# EAGLE design コントローラ (EAGLE 9.6.2)
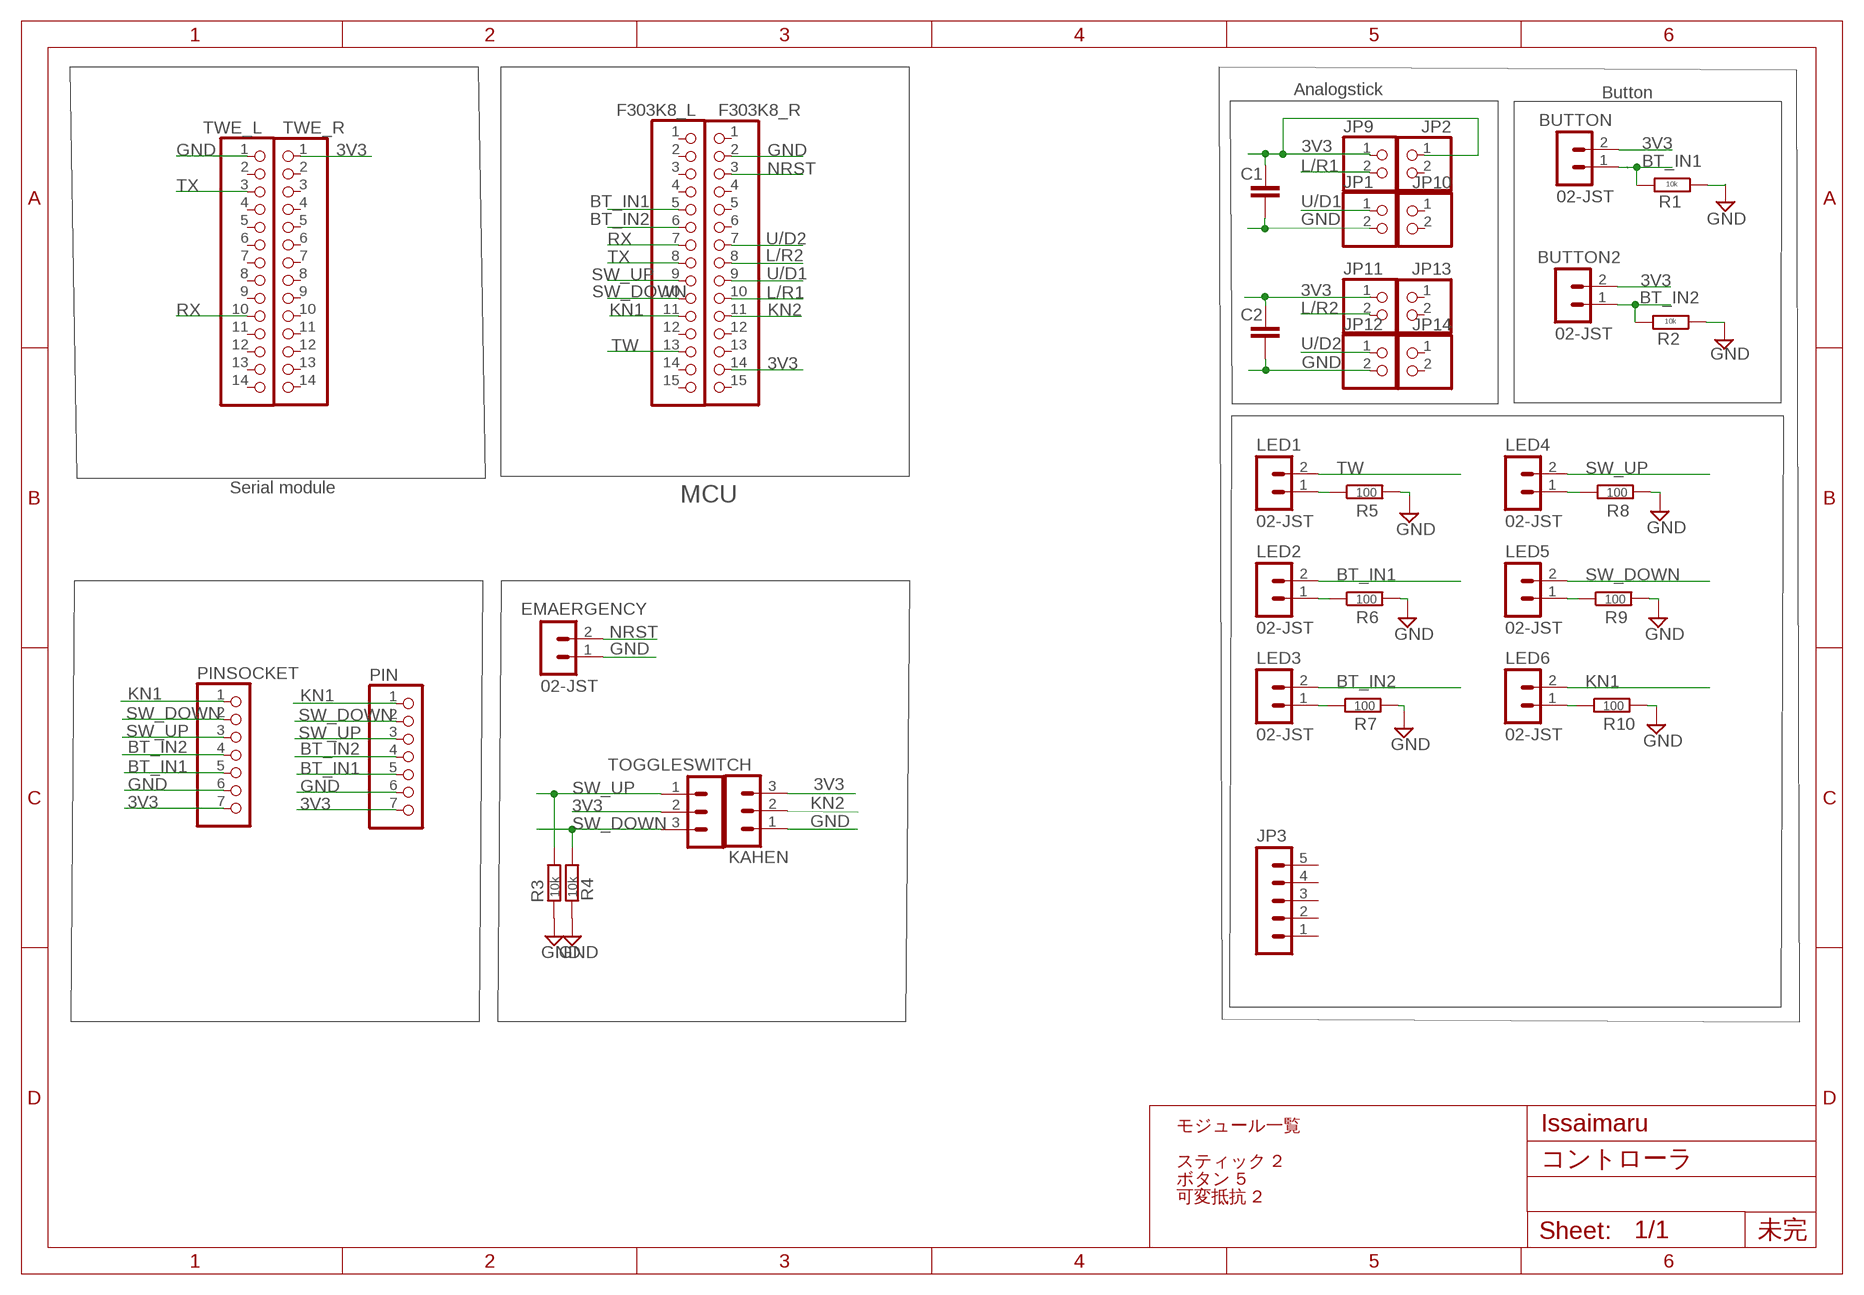
[diagram p0: schematic, sheet 1]

## Parts
BUTTON  02-JST  [B2B-XH]
BUTTON2  02-JST  [B2B-XH]
C1  C-EU025-024X044  [C025-024X044]
C2  C-EU025-024X044  [C025-024X044]
EMAERGENCY  02-JST  [B2B-XH]
F303K8_L  PINHD-1X15  [1X15]
F303K8_R  PINHD-1X15  [1X15]
JP1  PINHD-1X2  [1X02]
JP2  PINHD-1X2  [1X02]
JP3  05-JST  [B5B-XH]
JP9  PINHD-1X2  [1X02]
JP10  PINHD-1X2  [1X02]
JP11  PINHD-1X2  [1X02]
JP12  PINHD-1X2  [1X02]
JP13  PINHD-1X2  [1X02]
JP14  PINHD-1X2  [1X02]
KAHEN  03-JST  [B3B-XH]
LED1  02-JST  [B2B-XH]
LED2  02-JST  [B2B-XH]
LED3  02-JST  [B2B-XH]
LED4  02-JST  [B2B-XH]
LED5  02-JST  [B2B-XH]
LED6  02-JST  [B2B-XH]
PIN  PINHD-1X7  [1X07]
PINSOCKET  PINHD-1X7  [1X07]
R1  10k  R-EU_0204/7  [0204/7]
R2  10k  R-EU_0204/7  [0204/7]
R3  10k  R-EU_0204/7  [0204/7]
R4  10k  R-EU_0204/7  [0204/7]
R5  100  R-EU_0204/7  [0204/7]
R6  100  R-EU_0204/7  [0204/7]
R7  100  R-EU_0204/7  [0204/7]
R8  100  R-EU_0204/7  [0204/7]
R9  100  R-EU_0204/7  [0204/7]
R10  100  R-EU_0204/7  [0204/7]
TOGGLESWITCH  03-JST  [B3B-XH]
TWE_L  PINHD-1X14  [1X14]
TWE_R  PINHD-1X14  [1X14]

## Nets
3V3: BUTTON2.2 BUTTON.2 C1.1 C2.1 F303K8_R.14 JP9.1 JP11.1 KAHEN.3 PIN.7 PINSOCKET.7 TOGGLESWITCH.2 TWE_R.1
BT_IN1: BUTTON.1 F303K8_L.5 LED2.2 PIN.5 PINSOCKET.5 R1.2
BT_IN2: BUTTON2.1 F303K8_L.6 LED3.2 PIN.4 PINSOCKET.4 R2.2
GND: C1.2 C2.2 EMAERGENCY.1 F303K8_R.2 JP1.2 JP12.2 KAHEN.1 PIN.6 PINSOCKET.6 R1.1 R2.1 R3.1 R4.1 R5.2 R6.2 R7.2 R8.2 R9.2 R10.2 TWE_L.1
KN1: F303K8_L.11 LED6.2 PIN.1 PINSOCKET.1
KN2: F303K8_R.11 KAHEN.2
L/R1: F303K8_R.10 JP9.2
L/R2: F303K8_R.8 JP11.2
N$1: JP2.1
N$4: LED1.1 R5.1
N$5: LED2.1 R6.1
N$7: LED3.1 R7.1
N$9: LED6.1 R10.1
N$10: LED5.1 R9.1
N$11: LED4.1 R8.1
NRST: EMAERGENCY.2 F303K8_R.3
RX: F303K8_L.7 TWE_L.10
SW_DOWN: F303K8_L.10 LED5.2 PIN.2 PINSOCKET.2 R4.2 TOGGLESWITCH.3
SW_UP: F303K8_L.9 LED4.2 PIN.3 PINSOCKET.3 R3.2 TOGGLESWITCH.1
TW: F303K8_L.13 LED1.2
TX: F303K8_L.8 TWE_L.3
U/D1: F303K8_R.9 JP1.1
U/D2: F303K8_R.7 JP12.1
Unconnected: F303K8_L.1 F303K8_L.2 F303K8_L.3 F303K8_L.4 F303K8_L.12 F303K8_L.14 F303K8_L.15 F303K8_R.1 F303K8_R.4 F303K8_R.5 F303K8_R.6 F303K8_R.12 F303K8_R.13 F303K8_R.15 JP2.2 JP3.1 JP3.2 JP3.3 JP3.4 JP3.5 JP10.1 JP10.2 JP13.1 JP13.2 JP14.1 JP14.2 TWE_L.2 TWE_L.4 TWE_L.5 TWE_L.6 TWE_L.7 TWE_L.8 TWE_L.9 TWE_L.11 TWE_L.12 TWE_L.13 TWE_L.14 TWE_R.2 TWE_R.3 TWE_R.4 TWE_R.5 TWE_R.6 TWE_R.7 TWE_R.8 TWE_R.9 TWE_R.10 TWE_R.11 TWE_R.12 TWE_R.13 TWE_R.14

## Notes on the sheet
- Analogstick | Button
- Serial module
- MCU
- KAHEN
- モジュール一覧 | Issaimaru
- スティック 2
- ボタン 5
- 可変抵抗 2
- 未完

## Library data of the parts
BUTTON BUTTON2 EMAERGENCY = con-jst-xh:02-JST: JST CONNECTOR
C1 C2 = rcl:C-EU: CAPACITOR, European symbol; SPICEPREFIX: C
F303K8_L F303K8_R = pinhead:PINHD-1X15: PIN HEADER
JP1 JP2 JP9-JP14 = pinhead:PINHD-1X2: PIN HEADER
JP3 = con-jst-xh:05-JST: JST CONNECTOR
KAHEN TOGGLESWITCH = con-jst-xh (1):03-JST: JST CONNECTOR
LED1-LED6 = con-jst-xh (1):02-JST: JST CONNECTOR
PIN PINSOCKET = pinhead:PINHD-1X7: PIN HEADER
R1-R10 = rcl:R-EU_: RESISTOR, European symbol; SPICEPREFIX: R
TWE_L TWE_R = pinhead:PINHD-1X14: PIN HEADER

## Board
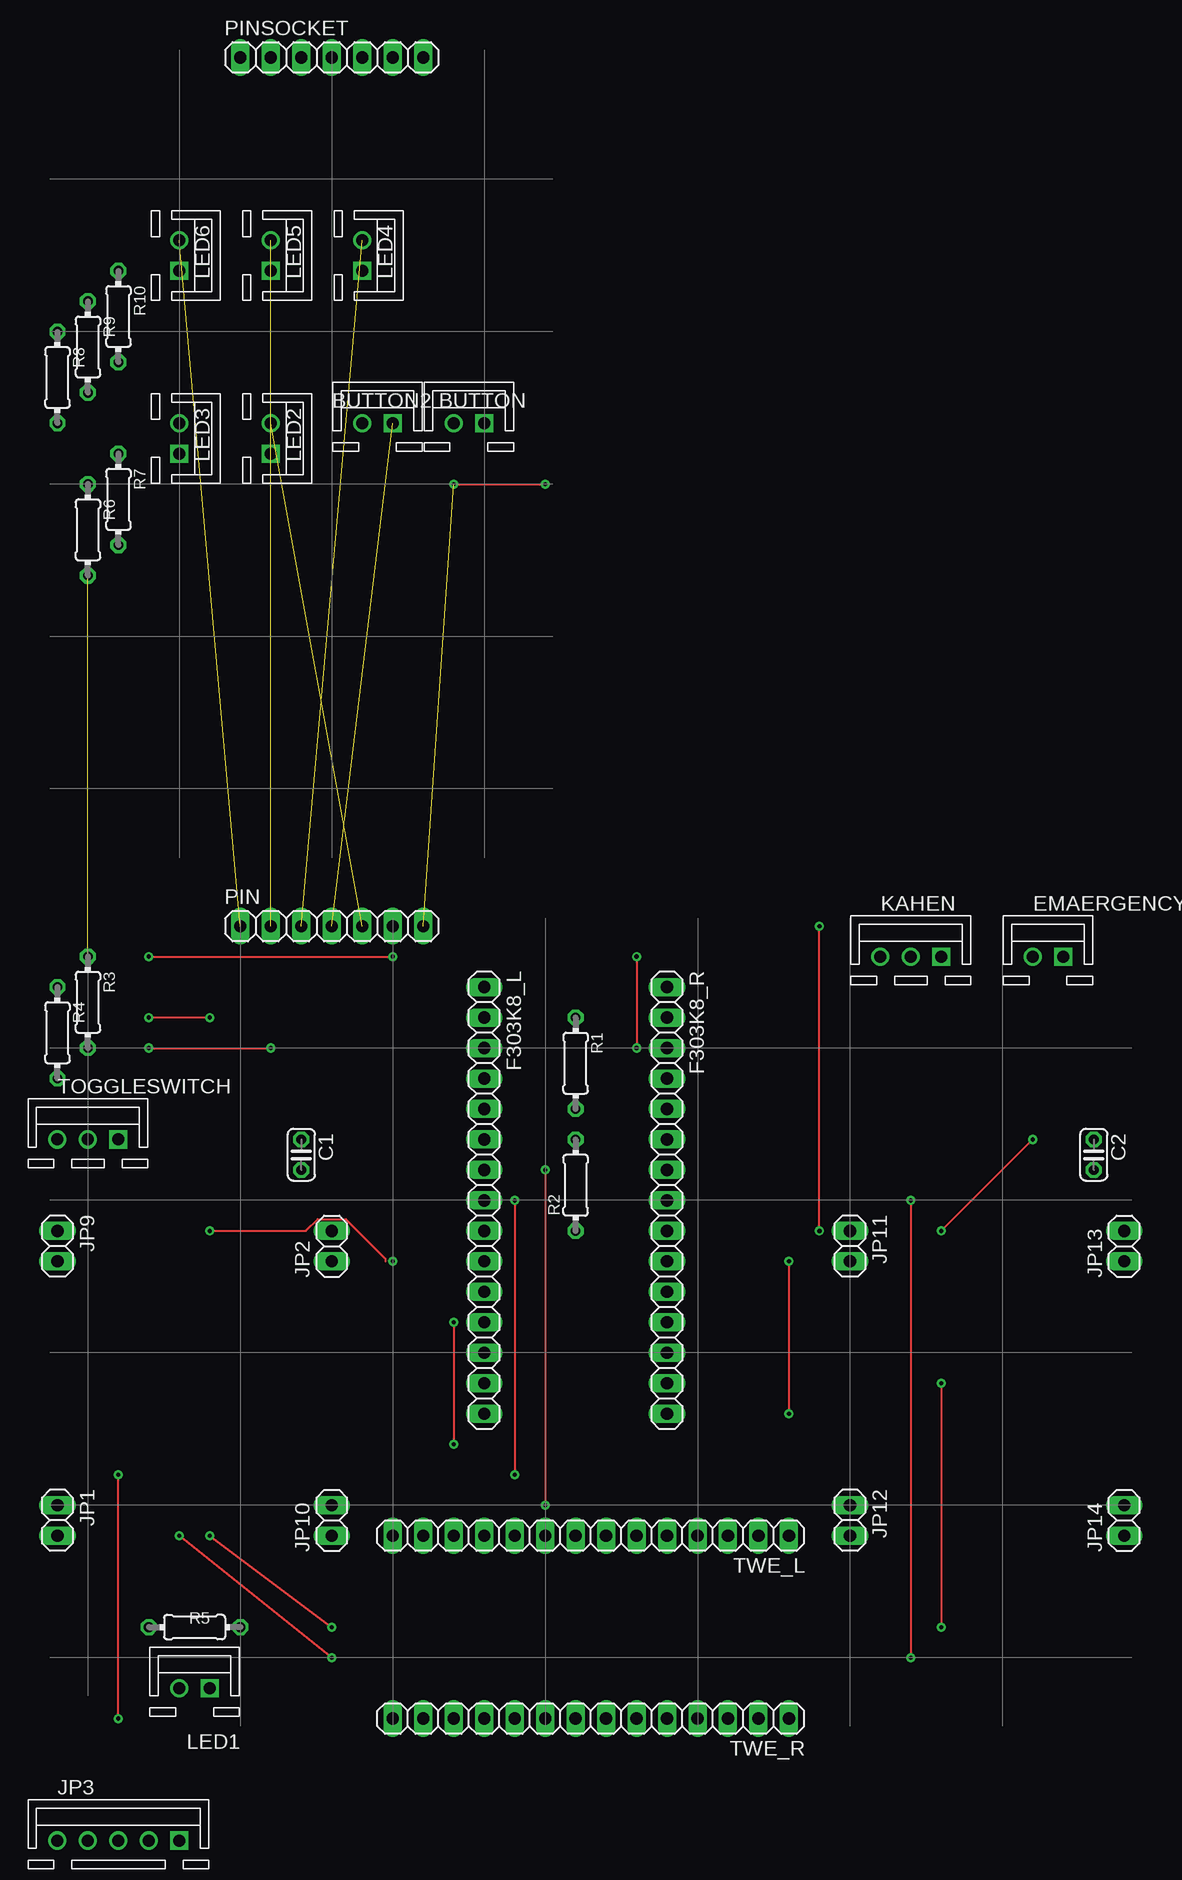
[diagram p1: board, top side]
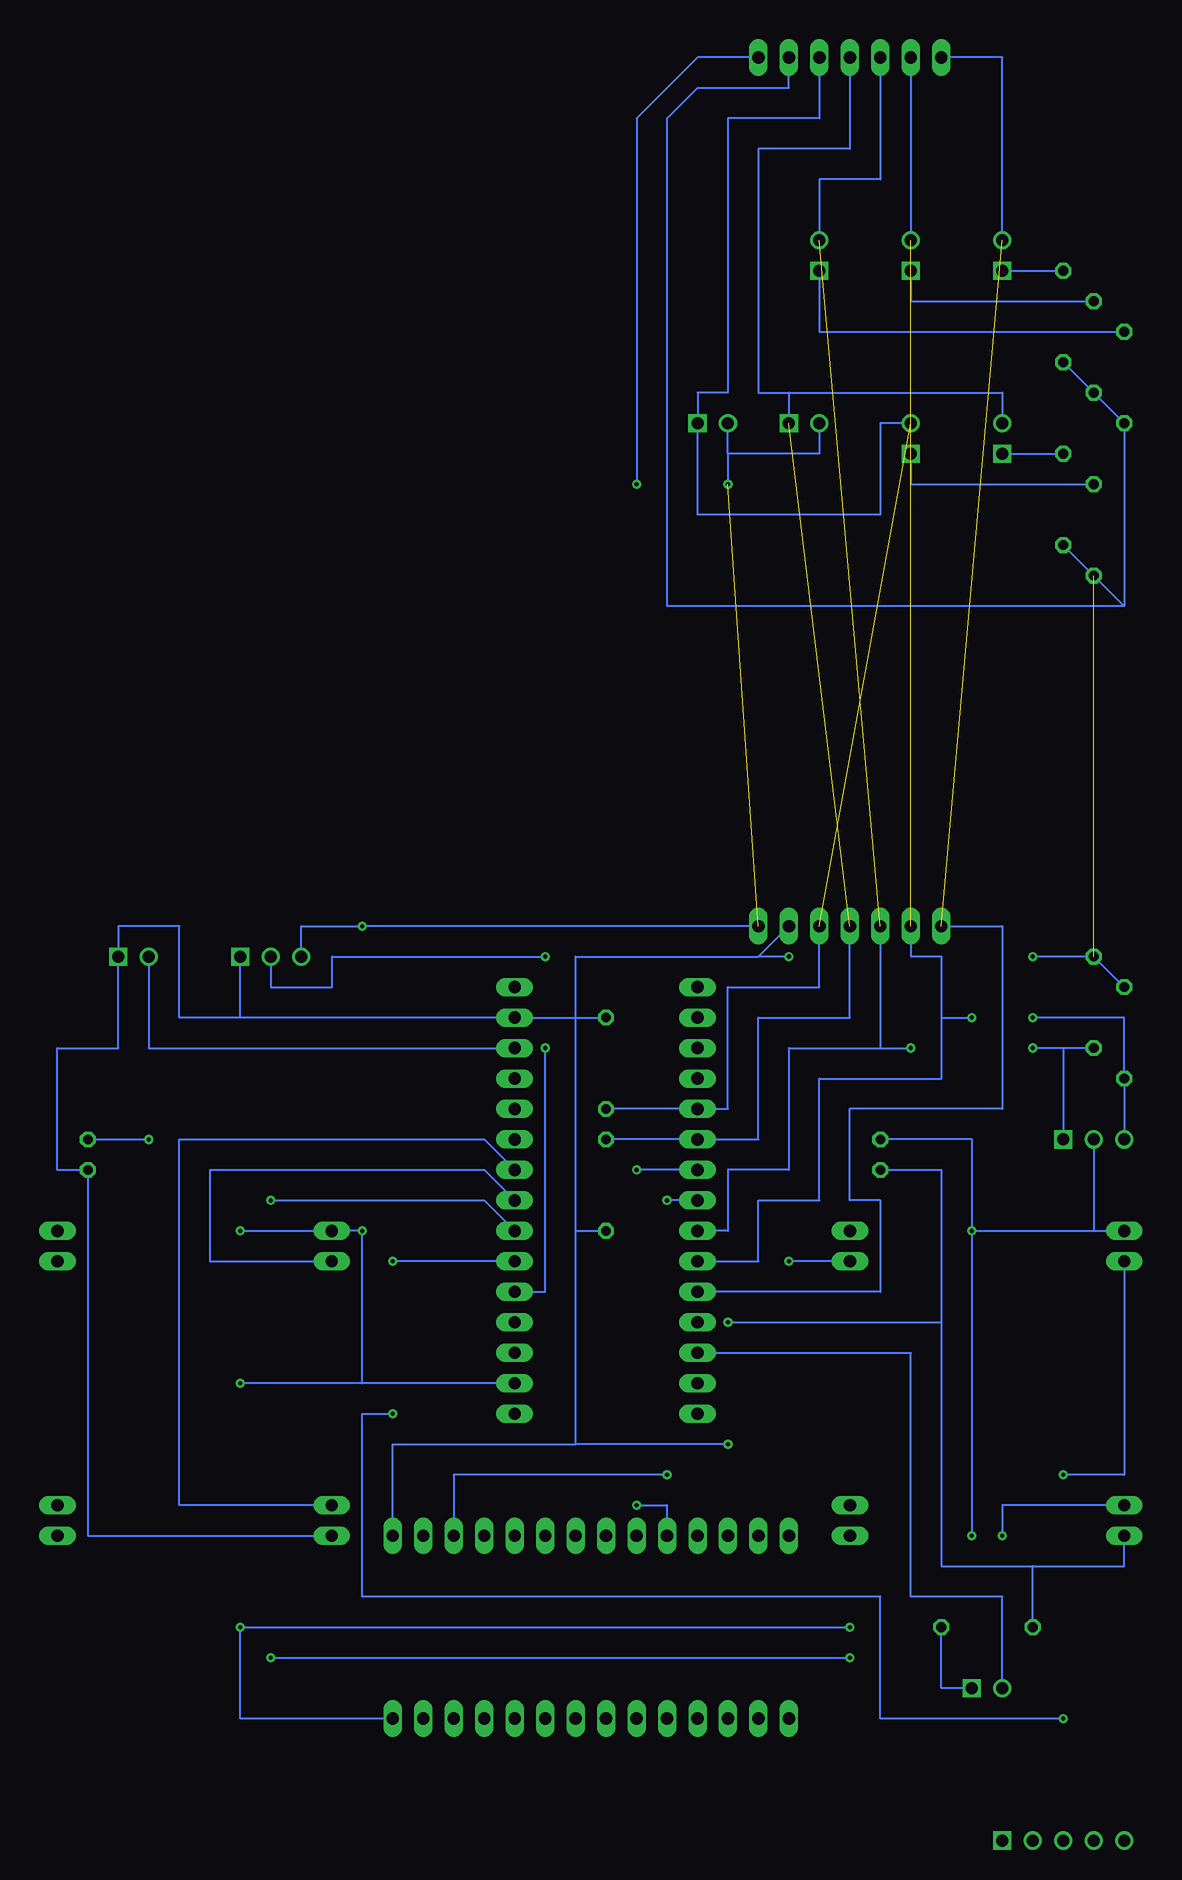
[diagram p2: board, bottom side, seen from below]

No outline drawn. Coordinates in mm, seen from the top.
Copper layers (1*16): Top 0.035mm / dielectric 1.5mm / Bottom 0.035mm
Design rules "default": minimum track width 6mil, minimum drill 0.35mm, track to track 6mil, track to pad 6mil, pad to pad 6mil, via to via 6mil, smd to smd 6mil, copper to edge 40mil, drill to drill 6mil, minimum pad ring 10mil, minimum via ring 8mil, stop-mask expansion 4mil, vias tented up to drill 0mil, thermal gap 10mil

### Footprints (pad centres in the part's own frame; a part is rotated, then mirrored left to right if it is on the bottom)
B2B-XH = drill 1 square: 1 1.27,0 | drill 1: 2 -1.27,0
C025-024X044 = drill 0.813 octagon: 1 -1.27,0; 2 1.27,0
1X15 = drill 1.016 long: 1 -17.78,0; 2 -15.24,0; 3 -12.7,0; 4 -10.16,0; 5 -7.62,0; 6 -5.08,0; 7 -2.54,0; 8 0,0; 9 2.54,0; 10 5.08,0; 11 7.62,0; 12 10.16,0; 13 12.7,0; 14 15.24,0; 15 17.78,0
1X02 = drill 1.016 long: 1 -1.27,0; 2 1.27,0
B5B-XH = drill 1 square: 1 5.08,0 | drill 1: 2 2.54,0; 3 0,0; 4 -2.54,0; 5 -5.08,0
B3B-XH = drill 1 square: 1 2.54,0 | drill 1: 2 0,0; 3 -2.54,0
1X07 = drill 1.016 long: 1 -7.62,0; 2 -5.08,0; 3 -2.54,0; 4 0,0; 5 2.54,0; 6 5.08,0; 7 7.62,0
0204/7 = drill 0.813 octagon: 1 -3.81,0; 2 3.81,0
1X14 = drill 1.016 long: 1 -16.51,0; 2 -13.97,0; 3 -11.43,0; 4 -8.89,0; 5 -6.35,0; 6 -3.81,0; 7 -1.27,0; 8 1.27,0; 9 3.81,0; 10 6.35,0; 11 8.89,0; 12 11.43,0; 13 13.97,0; 14 16.51,0

### Placement (x,y rotation side)
BUTTON  36.83,113.03 0 top
BUTTON2  29.21,113.03 0 top
C1  22.86,52.07 270 top
C2  88.9,52.07 270 top
EMAERGENCY  85.09,68.58 0 top
F303K8_L  38.1,48.26 270 top
F303K8_R  53.34,48.26 270 top
JP1  2.54,21.59 270 top
JP2  25.4,44.45 90 top
JP3  7.62,-5.08 0 top
JP9  2.54,44.45 270 top
JP10  25.4,21.59 90 top
JP11  68.58,44.45 270 top
JP12  68.58,21.59 270 top
JP13  91.44,44.45 90 top
JP14  91.44,21.59 90 top
KAHEN  73.66,68.58 0 top
LED1  13.97,7.62 0 top
LED2  20.32,111.76 270 top
LED3  12.7,111.76 270 top
LED4  27.94,127 270 top
LED5  20.32,127 270 top
LED6  12.7,127 270 top
PIN  25.4,71.12 0 top
PINSOCKET  25.4,143.51 0 top
R1  45.72,59.69 270 top
R2  45.72,49.53 90 top
R3  5.08,64.77 270 top
R4  2.54,62.23 270 top
R5  13.97,12.7 180 top
R6  5.08,104.14 270 top
R7  7.62,106.68 270 top
R8  2.54,116.84 270 top
R9  5.08,119.38 270 top
R10  7.62,121.92 270 top
TOGGLESWITCH  5.08,53.34 0 top
TWE_L  46.99,20.32 180 top
TWE_R  46.99,5.08 180 top
U$1  [TYPE.B]  93.98,73.66 180 top
U$2  [TYPE.C]  0,146.05 270 top

### Tracks (layer width: path | path; a pad name or v marks a point on that pad's centre or on a via)
3V3  (via drill 0.35)  (1 unrouted)
  Top 0.152: v83.82,53.34 v76.2,45.72 | v66.04,45.72 v66.04,71.12 | v35.56,107.95 v43.18,107.95 | v15.24,20.32 v25.4,12.7 | v76.2,33.02 v76.2,12.7 | v15.24,45.72 23.24,45.72 24.23,46.71 26.57,46.71 29.87,43.41 29.87,43.18
  Bottom 0.152: KAHEN.3 71.12,71.12 v66.04,71.12 PIN.7 | F303K8_R.14 66.04,33.02 | TWE_R.1 76.2,5.08 v76.2,12.7 v25.4,12.7 | v76.2,45.72 JP11.1 v66.04,45.72 66.04,33.02 | C2.1 v83.82,53.34 | TOGGLESWITCH.2 5.08,45.72 JP9.1 v15.24,45.72 | C1.1 15.24,53.34 v15.24,45.72 | PINSOCKET.7 38.1,143.51 43.18,138.43 v43.18,107.95 | BUTTON2.2 27.94,110.49 35.56,110.49 | 35.56,110.49 BUTTON.2 | 35.56,110.49 v35.56,107.95 | v15.24,45.72 v15.24,20.32 | 66.04,33.02 v76.2,33.02
BT_IN1  (1 unrouted)
  Bottom 0.152: PIN.5 27.94,66.04 35.56,66.04 35.56,55.88 F303K8_L.5 R1.2 | PINSOCKET.5 27.94,138.43 35.56,138.43 35.56,115.57 38.1,115.57 BUTTON.1 38.1,105.41 22.86,105.41 22.86,113.03 LED2.2
BT_IN2  (1 unrouted)
  Bottom 0.152: PIN.4 25.4,63.5 33.02,63.5 33.02,53.34 F303K8_L.6 R2.2 | PINSOCKET.4 25.4,135.89 33.02,135.89 33.02,115.57 30.48,115.57 | 30.48,115.57 BUTTON2.1 | 30.48,115.57 12.7,115.57 LED3.2
GND  (via drill 0.35)  (1 unrouted)
  Top 0.152: v35.56,38.1 v35.56,27.94 | v10.16,68.58 v30.48,68.58
  Bottom 0.152: 76.2,63.5 F303K8_R.2 48.26,63.5 | 76.2,63.5 KAHEN.1 | TWE_L.1 63.5,27.94 48.26,27.94 | 48.26,45.72 R2.1 | JP12.2 88.9,20.32 C2.2 91.44,50.8 91.44,60.96 86.36,60.96 EMAERGENCY.1 86.36,71.12 81.28,71.12 81.28,63.5 76.2,63.5 | C1.2 17.78,50.8 17.78,38.1 | 17.78,38.1 17.78,17.78 10.16,17.78 | 10.16,17.78 2.54,17.78 JP1.2 | 48.26,63.5 48.26,68.58 33.02,68.58 | 48.26,63.5 R1.1 | 48.26,27.94 48.26,45.72 | 48.26,45.72 48.26,63.5 | R4.1 R3.1 v10.16,68.58 | v35.56,38.1 17.78,38.1 | v35.56,27.94 48.26,27.94 | 33.02,68.58 PIN.6 | v30.48,68.58 33.02,68.58 | R10.2 R9.2 R8.2 2.54,97.79 | R7.2 R6.2 2.54,97.79 | 2.54,97.79 40.64,97.79 40.64,138.43 38.1,140.97 30.48,140.97 PINSOCKET.6 | R5.2 10.16,17.78
KN1  (1 unrouted)
  Bottom 0.152: PINSOCKET.1 12.7,143.51 LED6.2 | PIN.1 12.7,71.12 12.7,55.88 25.4,55.88 25.4,48.26 22.86,48.26 22.86,40.64 F303K8_L.11
KN2  (via drill 0.35)
  Top 0.152: v50.8,68.58 v50.8,60.96
  Bottom 0.152: KAHEN.2 73.66,66.04 68.58,66.04 68.58,68.58 v50.8,68.58 | v50.8,60.96 50.8,40.64 F303K8_R.11
L/R1  (via drill 0.35)
  Top 0.152: v7.62,5.08 v7.62,25.4 | v63.5,43.18 v63.5,30.48
  Bottom 0.152: F303K8_R.10 v63.5,43.18 | v7.62,5.08 22.86,5.08 22.86,15.24 66.04,15.24 66.04,30.48 v63.5,30.48 | JP9.2 2.54,25.4 v7.62,25.4
L/R2
  Bottom 0.152: F303K8_R.8 55.88,50.8 78.74,50.8 78.74,43.18 JP11.2
N$1  (via drill 0.35)
  Bottom 0.152: JP2.1 v30.48,43.18
N$4
  Bottom 0.152: LED1.1 17.78,7.62 R5.1
N$5
  Bottom 0.152: LED2.1 20.32,107.95 R6.1
N$7
  Bottom 0.152: LED3.1 R7.1
N$9
  Bottom 0.152: LED6.1 R10.1
N$10
  Bottom 0.152: LED5.1 20.32,123.19 R9.1
N$11
  Bottom 0.152: LED4.1 27.94,120.65 R8.1
NRST
  Bottom 0.152: EMAERGENCY.2 83.82,60.96 F303K8_R.3
RX  (via drill 0.35)
  Top 0.152: v43.18,50.8 v43.18,22.86
  Bottom 0.152: F303K8_L.7 v43.18,50.8 | TWE_L.10 40.64,22.86 v43.18,22.86
SW_DOWN  (via drill 0.35)  (1 unrouted)
  Top 0.152: v15.24,63.5 v10.16,63.5
  Bottom 0.152: PIN.2 20.32,68.58 17.78,68.58 17.78,63.5 | 17.78,63.5 17.78,58.42 27.94,58.42 27.94,48.26 33.02,48.26 33.02,43.18 F303K8_L.10 | TOGGLESWITCH.3 R4.2 2.54,63.5 v10.16,63.5 | 17.78,63.5 v15.24,63.5 | PINSOCKET.2 LED5.2
SW_UP  (via drill 0.35)  (1 unrouted)
  Top 0.152: v10.16,60.96 v20.32,60.96
  Bottom 0.152: 22.86,60.96 30.48,60.96 30.48,50.8 35.56,50.8 35.56,45.72 F303K8_L.9 | PIN.3 22.86,60.96 | R3.2 7.62,60.96 | 7.62,60.96 TOGGLESWITCH.1 | 7.62,60.96 v10.16,60.96 | 22.86,60.96 v20.32,60.96 | PINSOCKET.3 22.86,133.35 27.94,133.35 LED4.2
TW
  Bottom 0.152: F303K8_L.13 20.32,35.56 20.32,15.24 12.7,15.24 LED1.2
TX  (via drill 0.35)
  Top 0.152: v40.64,48.26 v40.64,25.4
  Bottom 0.152: v40.64,25.4 58.42,25.4 TWE_L.3 | F303K8_L.8 v40.64,48.26
U/D1  (via drill 0.35)
  Top 0.152: v25.4,10.16 v12.7,20.32 | v73.66,48.26 v73.66,10.16
  Bottom 0.152: v73.66,48.26 55.88,48.26 F303K8_R.9 | v73.66,10.16 v25.4,10.16 | JP1.1 12.7,22.86 v12.7,20.32
U/D2
  Bottom 0.152: JP12.1 81.28,22.86 81.28,53.34 55.88,53.34 F303K8_R.7